# EAGLE design Vending_Machine (EAGLE 9.4.1)
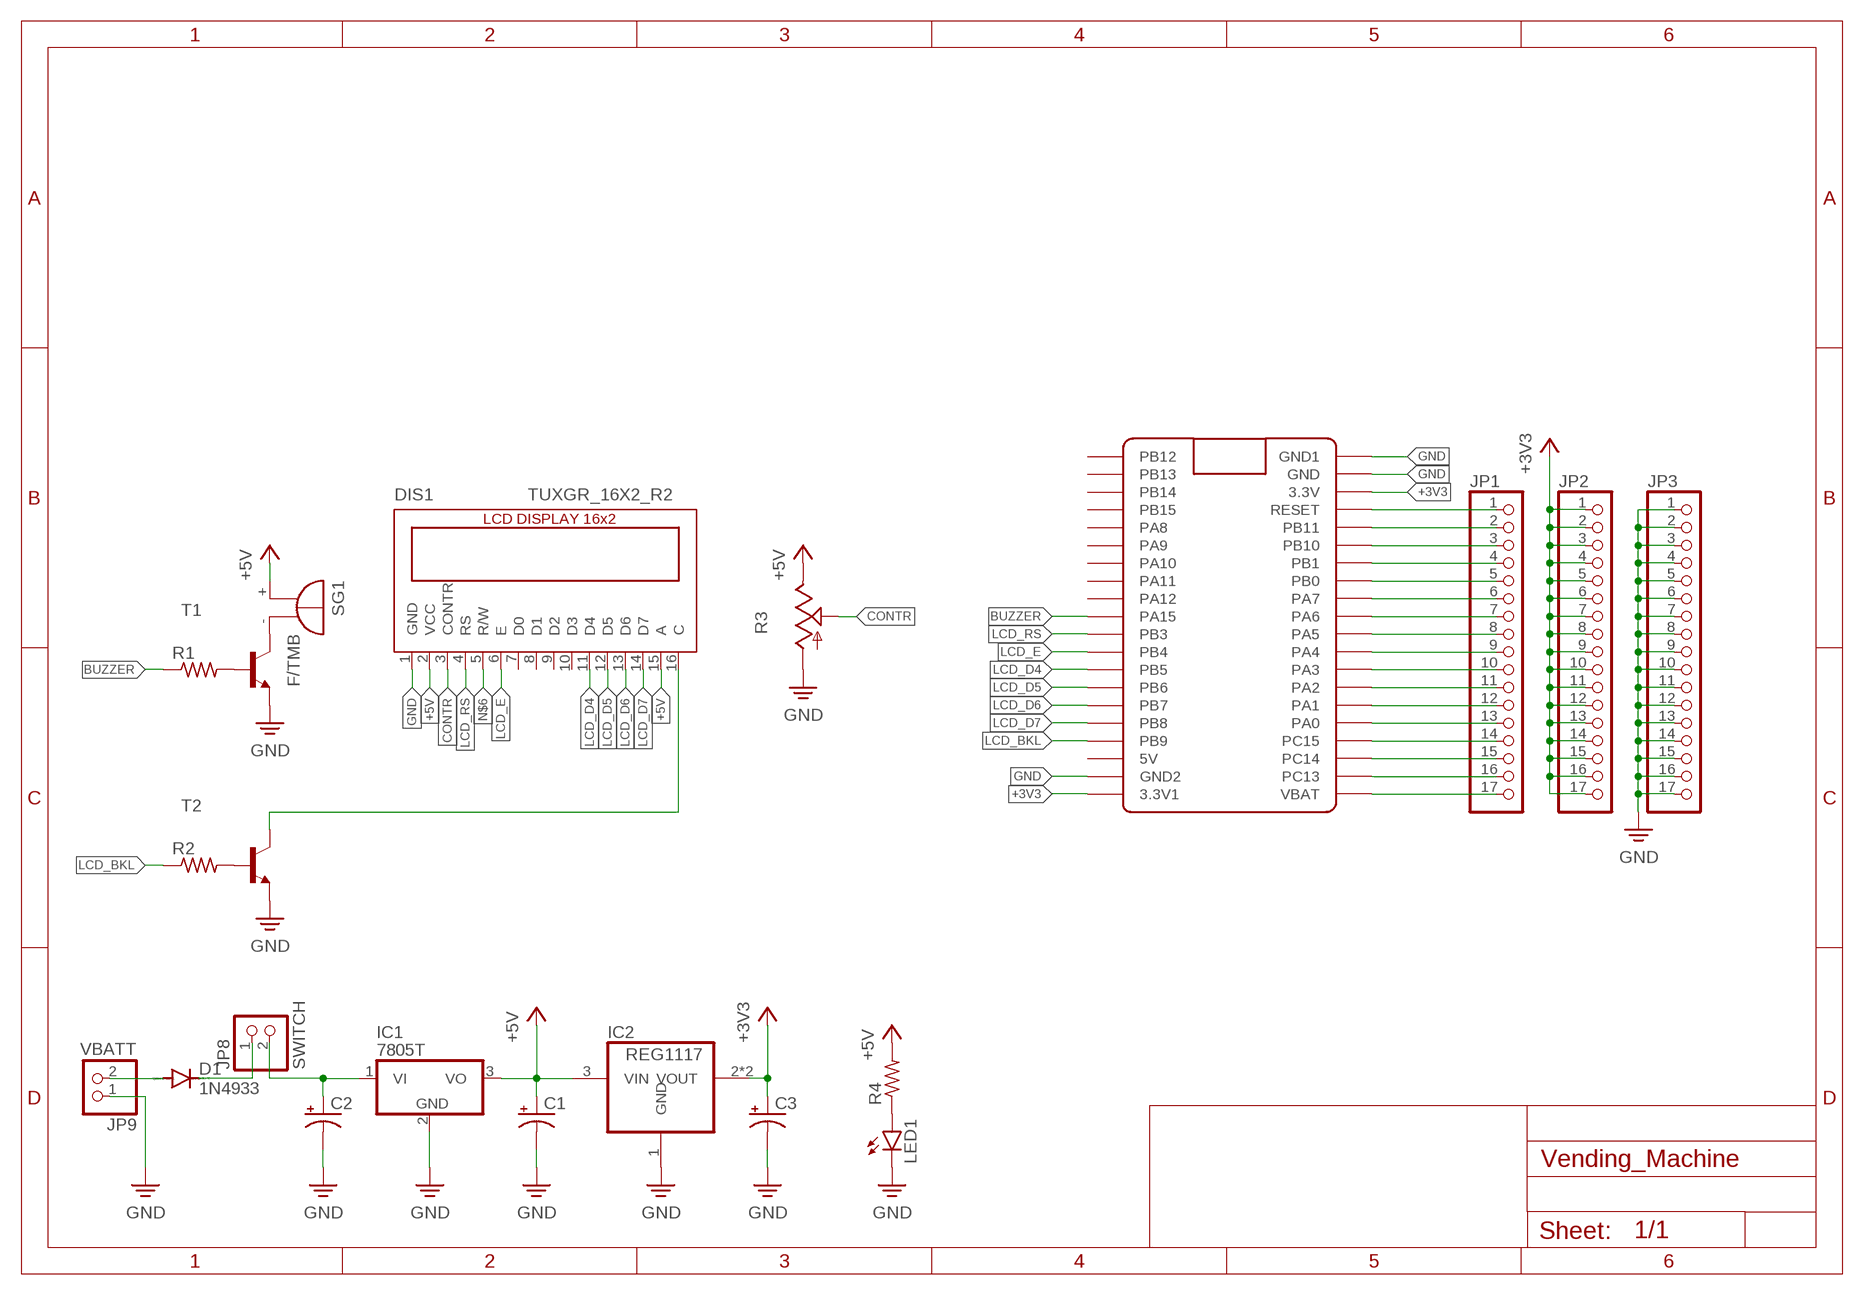
[diagram p0: schematic, sheet 1]

## Parts
C1  CPOL-USE2.5-6  [E2,5-6]
C2  CPOL-USE2.5-6  [E2,5-6]
C3  CPOL-USE2.5-6  [E2,5-6]
D1  1N4933  [DO41-10]
DIS1  TUXGR_16X2_R2  [TUXGR_16X2_R2]
IC1  7805T  [TO220H]
IC2  REG1117  [SOT223]
JP1  PINHD-1X17  [1X17]
JP2  PINHD-1X17  [1X17]
JP3  PINHD-1X17  [1X17]
JP8  SWITCH  PINHD-1X2  [1X02]
JP9  VBATT  PINHD-1X2  [1X02]
LED1  LED3MM  [LED3MM]
R1  R-US_0204/7  [0204/7]
R2  R-US_0204/7  [0204/7]
R3  TRIM_US-CA6V  [CA6V]
R4  R-US_0204/7  [0204/7]
SG1  F/TMB  [F/TMB]
T1  BC167-NPN-TO92-ECB  [TO92-ECB]
T2  BC167-NPN-TO92-ECB  [TO92-ECB]
U$1  BLUE_PILL  [BLUE_PILL]

## Nets
+3V3: C3.+ IC2.2(VOUT) IC2.4(VOUT) JP2.1 JP2.2 JP2.3 JP2.4 JP2.5 JP2.6 JP2.7 JP2.8 JP2.9 JP2.10 JP2.11 JP2.12 JP2.13 JP2.14 JP2.15 JP2.16 JP2.17 U$1.P$20(3.3V1) U$1.P$23(3.3V)
+5V: C1.+ DIS1.2(VCC) DIS1.15(A) IC1.3(VO) IC2.3(VIN) R3.E R4.2 SG1.+
BUZZER: R1.1 U$1.P$10(PA15)
CONTR: DIS1.3(CONTR) R3.S
GND: C1.- C2.- C3.- DIS1.1(GND) IC1.2(GND) IC2.1(GND) JP3.1 JP3.2 JP3.3 JP3.4 JP3.5 JP3.6 JP3.7 JP3.8 JP3.9 JP3.10 JP3.11 JP3.12 JP3.13 JP3.14 JP3.15 JP3.16 JP3.17 JP9.1 LED1.K(C) R3.A T1.E T2.E U$1.P$19(GND2) U$1.P$21(GND1) U$1.P$22(GND)
LCD_BKL: R2.1 U$1.P$17(PB9)
LCD_D4: DIS1.11(D4) U$1.P$13(PB5)
LCD_D5: DIS1.12(D5) U$1.P$14(PB6)
LCD_D6: DIS1.13(D6) U$1.P$15(PB7)
LCD_D7: DIS1.14(D7) U$1.P$16(PB8)
LCD_E: DIS1.6(E) U$1.P$12(PB4)
LCD_RS: DIS1.4(RS) U$1.P$11(PB3)
N$1: SG1.- T1.C
N$2: R1.2 T1.B
N$3: R2.2 T2.B
N$4: JP1.17 U$1.P$40(VBAT)
N$5: C2.+ IC1.1(VI) JP8.2
N$6: DIS1.5(R/W)
N$7: D1.C JP8.1
N$8: D1.A JP9.2
N$9: LED1.A R4.1
N$18: DIS1.16(C) T2.C
PA0: JP1.13 U$1.P$36(PA0)
PA1: JP1.12 U$1.P$35(PA1)
PA2: JP1.11 U$1.P$34(PA2)
PA3: JP1.10 U$1.P$33(PA3)
PA4: JP1.9 U$1.P$32(PA4)
PA5: JP1.8 U$1.P$31(PA5)
PA6: JP1.7 U$1.P$30(PA6)
PB1: JP1.4 U$1.P$27(PB1)
PB10: JP1.3 U$1.P$26(PB10)
PB11: JP1.2 U$1.P$25(PB11)
PB_BATAL: JP1.6 U$1.P$29(PA7)
PB_START: JP1.5 U$1.P$28(PB0)
PC13: JP1.16 U$1.P$39(PC13)
PC14: JP1.15 U$1.P$38(PC14)
PC15: JP1.14 U$1.P$37(PC15)
RESET: JP1.1 U$1.P$24(RESET)
Unconnected: DIS1.7(D0) DIS1.8(D1) DIS1.9(D2) DIS1.10(D3) U$1.P$1(PB12) U$1.P$2(PB13) U$1.P$3(PB14) U$1.P$4(PB15) U$1.P$5(PA8) U$1.P$6(PA9) U$1.P$7(PA10) U$1.P$8(PA11) U$1.P$9(PA12) U$1.P$18(5V)

## Library data of the parts
C1-C3 = rcl:CPOL-US: POLARIZED CAPACITOR, American symbol; SPICEPREFIX: C
D1 = diode:1N4933: DIODE fast recovery rectifier, 1A
DIS1 = display-lcd:TUXGR_16X2_R2: Tuxgraphics LCD display 16x2 characters reflective, without background light Source: tuxgr_12x2_r2.pdf; OC_FARNELL: unknown; OC_NEWARK: unknown
IC1 = linear:78*: Positive VOLTAGE REGULATOR Source: http://cache.national.com/ds/LM/LM78L05.pdf http://www.fairchildsemi.com/ds/LM/LM7805.pdf
IC2 = burr-brown:REG1117: 800mA and 1A Low Dropout (LDO) Positive Regulator 1.8V, 2.5V, 2.85V, 3.3V, 5V, and Adj; MPN: REG1117; OC_FARNELL: 1097566; OC_NEWARK: 14P6981
JP1-JP3 = pinhead:PINHD-1X17: PIN HEADER
JP8 JP9 = pinhead:PINHD-1X2: PIN HEADER
LED1 = led:LED: LED OSRAM: - CHIPLED LG R971, LG N971, LY N971, LG Q971, LY Q971, LO R971, LY R971 LH N974, LH R974 LS Q976, LO Q976, LY Q976 LO Q996 - Hyper CHIPLED LW Q18S LB Q993, LB Q99A, LB R99A - SideLED LS A670, LO A670, LY A670, LG A670, LP A670 LB A673, LV A673, LT A673, LW A673 LH A674 LY A675 LS A676, LA A676, LO A676, LY A676, LW A676 LS A679, LY A679, LG A679 - Hyper Micro SIDELED® LS Y876, LA Y876, LO Y876, LY Y876 LT Y87S - SmartLED LW L88C, LW L88S LB L89C, LB L89S, LG L890 LS L89K, LO L89K, LY L89K LS L896, LA L896, LO L896, LY L896 - TOPLED LS T670, LO T670, LY T670, LG T670, LP T670 LSG T670, LSP T670, LSY T670, LOP T670, LYG T670 LG T671, LOG T671, LSG T671 LB T673, LV T673, LT T673, LW T673 LH T674 LS T676, LA T676, LO T676, LY T676, LB T676, LH T676, LSB T676, LW T676 LB T67C, LV T67C, LT T67C, LS T67K, LO T67K, LY T67K, LW E67C LS E67B, LA E67B, LO E67B, LY E67B, LB E67C, LV E67C, LT E67C LW T67C LS T679, LY T679, LG T679 LS T770, LO T770, LY T770, LG T770, LP T770 LB T773, LV T773, LT T773, LW T773 LH T774 LS E675, LA E675, LY E675, LS T675 LS T776, LA T776, LO T776, LY T776, LB T776 LHGB T686 LT T68C, LB T68C - Hyper Mini TOPLED® LB M676 - Mini TOPLED Santana® LG M470 LS M47K, LO M47K, LY M47K Source: http://www.osram.convergy.de LUXEON: - LUMILED® LXK2-PW12-R00, LXK2-PW12-S00, LXK2-PW14-U00, LXK2-PW14-V00 LXK2-PM12-R00, LXK2-PM12-S00, LXK2-PM14-U00 LXK2-PE12-Q00, LXK2-PE12-R00, LXK2-PE12-S00, LXK2-PE14-T00, LXK2-PE14-U00 LXK2-PB12-K00, LXK2-PB12-L00, LXK2-PB12-M00, LXK2-PB14-N00, LXK2-PB14-P00, LXK2-PB14-Q00 LXK2-PR12-L00, LXK2-PR12-M00, LXK2-PR14-Q00, LXK2-PR14-R00 LXK2-PD12-Q00, LXK2-PD12-R00, LXK2-PD12-S00 LXK2-PH12-R00, LXK2-PH12-S00 LXK2-PL12-P00, LXK2-PL12-Q00, LXK2-PL12-R00 Source: www.luxeon.com KINGBRIGHT: KA-3528ASYC Source: www.kingbright.com
R1 R2 R4 = rcl:R-US_: RESISTOR, American symbol; SPICEPREFIX: R
R3 = pot:TRIM_US-: POTENTIOMETER
SG1 = buzzer:F/TMB: BUZZER Source: Buerklin; OC_FARNELL: unknown; OC_NEWARK: unknown
T1 T2 = transistor:*-NPN-: NPN Transistror BF959 corrected 2008.03.06
U$1 = BluePill:BLUE_PILL

## Board
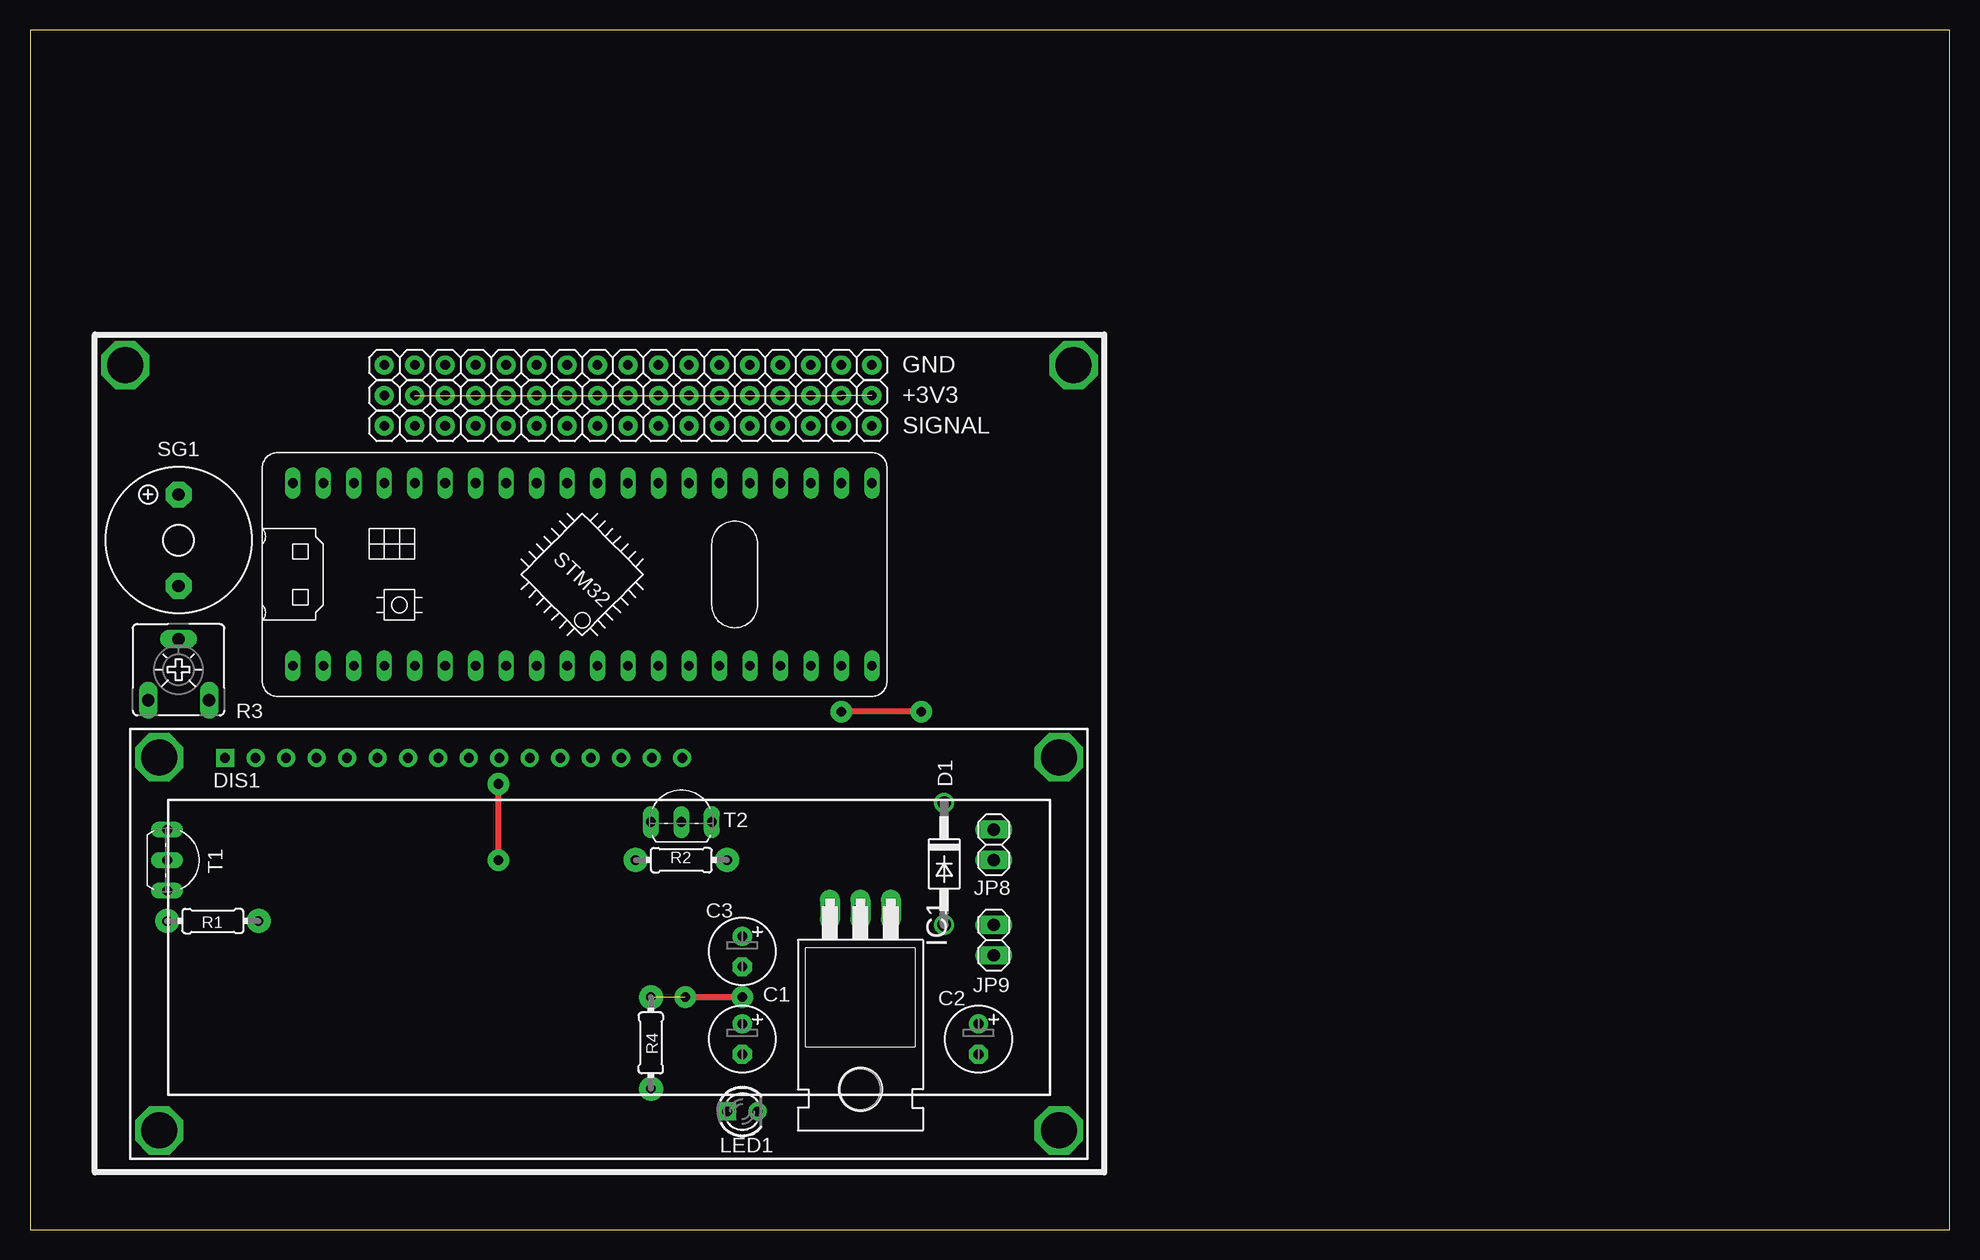
[diagram p1: board, top side]
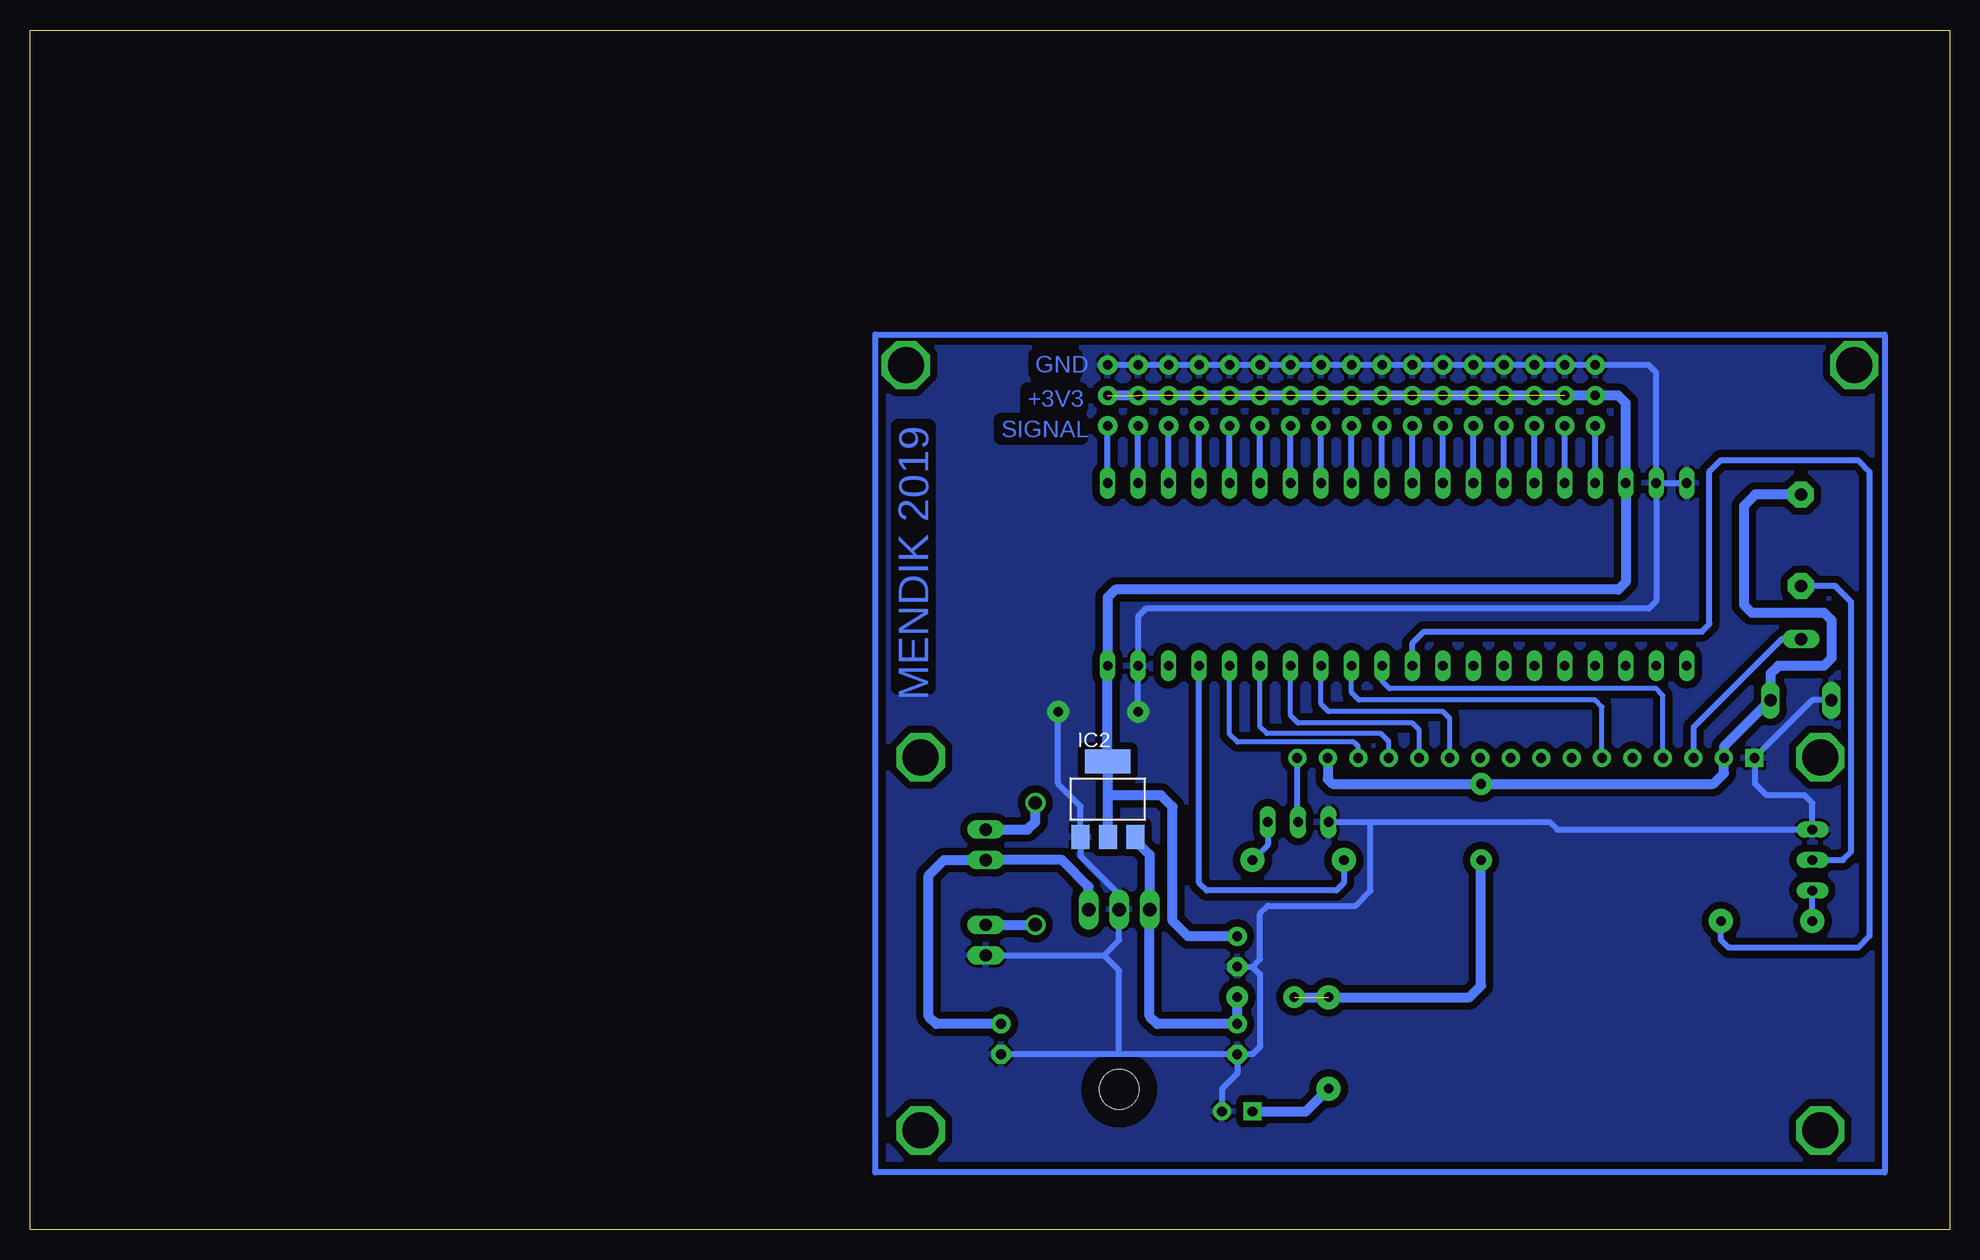
[diagram p2: board, bottom side, seen from below]

Size 160 x 100 mm. Coordinates in mm from the lower left corner, seen from the top.
Outline: 0,0 160,0 160,100 0,100 0,0
Copper layers (1*16): Top 0.035mm / dielectric 1.5mm / Bottom 0.035mm
Design rules "default *": minimum track width 6mil, minimum drill 0.35mm, track to track 12mil, track to pad 12mil, pad to pad 12mil, via to via 12mil, smd to smd 12mil, copper to edge 40mil, drill to drill 6mil, minimum pad ring 10mil, minimum via ring 8mil, stop-mask expansion 4mil, vias tented up to drill 0mil, thermal gap 10mil

### Footprints (pad centres in the part's own frame; a part is rotated, then mirrored left to right if it is on the bottom)
E2,5-6 = drill 0.813 pad 1.6: + -1.27,0 | drill 0.813 pad 1.6 octagon: - 1.27,0
DO41-10 = drill 1.118: A 5.08,0; C -5.08,0
TUXGR_16X2_R2 = drill 0.8 pad 1.5 square: 1 -32,15.5 | drill 0.8 pad 1.5: 2 -29.46,15.5; 3 -26.92,15.5; 4 -24.38,15.5; 5 -21.84,15.5; 6 -19.3,15.5; 7 -16.76,15.5; 8 -14.22,15.5; 9 -11.68,15.5; 10 -9.14,15.5; 11 -6.6,15.5; 12 -4.06,15.5; 13 -1.52,15.5; 14 1.02,15.5; 15 3.56,15.5; 16 6.1,15.5 | drill 3 pad 4 octagon: P$1 -37.494,15.557; P$2 37.494,15.557; P$3 -37.494,-15.557; P$4 37.494,-15.557
TO220H = drill 1.118 long: 1 -2.54,-10.16; 2 0,-10.16; 3 2.54,-10.16 | hole 3.302: 0,4.826
SOT223 = smd 1.499 x 2.007: 1 -2.261,-3.15; 2 0.025,-3.15; 3 2.311,-3.15 | smd 3.81 x 2.007: 4 0,3.15
1X17 = drill 0.8 pad 1.6: 1 -20.32,0; 2 -17.78,0; 3 -15.24,0; 4 -12.7,0; 5 -10.16,0; 6 -7.62,0; 7 -5.08,0; 8 -2.54,0; 9 0,0; 10 2.54,0; 11 5.08,0; 12 7.62,0; 13 10.16,0; 14 12.7,0; 15 15.24,0; 16 17.78,0; 17 20.32,0
1X02 = drill 1.016 long: 1 -1.27,0; 2 1.27,0
LED3MM = drill 0.813 pad 1.5 square: A -1.27,0 | drill 0.813 pad 1.5: K 1.27,0
0204/7 = drill 0.813 pad 2: 1 -3.81,0; 2 3.81,0
CA6V = drill 1.016 long: A -2.54,-2.54; E 2.54,-2.54; S 0,2.54
F/TMB = drill 1.016 pad 2.159 octagon: + 3.81,0; - -3.81,0
TO92-ECB = drill 0.813 long: B 2.54,0; C 0,0; E -2.54,0
BLUE_PILL = drill 0.8 long: P$1 -7.62,15.24; P$2 -7.62,12.7; P$3 -7.62,10.16; P$4 -7.62,7.62; P$5 -7.62,5.08; P$6 -7.62,2.54; P$7 -7.62,0; P$8 -7.62,-2.54; P$9 -7.62,-5.08; P$10 -7.62,-7.62; P$11 -7.62,-10.16; P$12 -7.62,-12.7; P$13 -7.62,-15.24; P$14 -7.62,-17.78; P$15 -7.62,-20.32; P$16 -7.62,-22.86; P$17 -7.62,-25.4; P$18 -7.62,-27.94; P$19 -7.62,-30.48; P$20 -7.62,-33.02; P$21 7.62,15.24; P$22 7.62,12.7; P$23 7.62,10.16; P$24 7.62,7.62; P$25 7.62,5.08; P$26 7.62,2.54; P$27 7.62,0; P$28 7.62,-2.54; P$29 7.62,-5.08; P$30 7.62,-7.62; P$31 7.62,-10.16; P$32 7.62,-12.7; P$33 7.62,-15.24; P$34 7.62,-17.78; P$35 7.62,-20.32; P$36 7.62,-22.86; P$37 7.62,-25.4; P$38 7.62,-27.94; P$39 7.62,-30.48; P$40 7.62,-33.02

### Placement (x,y rotation side)
C1  59.37,15.88 270 top
C2  79.06,15.88 270 top
C3  59.37,23.18 270 top
D1  76.2,30.48 270 top
DIS1  48.26,23.81 0 top
IC1  69.22,16.51 180 top
IC2  70.17,35.88 0 bottom
JP1  49.85,66.99 0 top
JP2  49.85,69.53 0 top
JP3  49.85,72.07 0 top
JP8  80.33,32.07 270 top
JP9  80.33,24.13 90 top
LED1  59.37,9.84 0 top
R1  15.24,25.72 180 top
R2  54.29,30.8 0 top
R3  12.38,46.67 0 top
R4  51.75,15.56 90 top
SG1  12.38,57.47 90 top
T1  11.43,30.8 270 top
T2  54.29,33.97 0 top
U$1  37.15,54.61 90 top

### Tracks (layer width: path | path; a pad name or v marks a point on that pad's centre or on a via)
+3V3  (15 unrouted)
  Bottom 0.508: IC2.4 70.17,39.69 70.14,39.66
  Bottom 0.813: 70.17,39.69 U$1.P$20 70.17,52.7 69.53,53.34 27.62,53.34 26.99,53.98 U$1.P$23 26.99,68.9 27.62,69.53 JP2.1 JP2.17 | IC2.2 70.14,36.2 | 70.14,36.2 70.14,39.66 | C3.+ 63.5,24.45 64.77,25.72 64.77,35.24 65.72,36.2 70.14,36.2
+5V  (via drill 0.8 pad 1.8)  (1 unrouted)
  Top 0.508: v59.37,19.37 v54.61,19.37 | v39.05,30.8 v39.05,37.15
  Bottom 0.508: 67.86,32.41 IC2.3
  Bottom 0.813: SG1.+ 16.19,61.28 17.14,60.33 17.14,52.07 16.51,51.44 10.48,51.44 9.84,50.8 9.84,47.62 10.48,46.99 14.29,46.99 14.92,46.35 R3.E 18.8,40.26 DIS1.2 18.8,38.03 19.68,37.15 v39.05,37.15 51.44,37.15 51.82,37.53 DIS1.15 | 67.86,32.41 66.67,31.23 IC1.3 66.67,17.78 66.04,17.14 C1.+ v59.37,19.37 | v54.61,19.37 40.01,19.37 39.05,20.32 v39.05,30.8
BUZZER
  Bottom 0.508: U$1.P$10 44.77,48.9 43.81,49.85 20.64,49.85 20,50.48 20,63.18 19.05,64.14 7.62,64.14 6.67,63.18 6.67,24.45 7.62,23.5 18.41,23.5 19.05,24.13 R1.1
CONTR
  Bottom 0.508: R3.S 13.98,49.21 21.34,41.85 DIS1.3
GND  (via drill 0.8 pad 1.8)
  Top 0.508: v74.3,43.18 v67.63,43.18
  Bottom 0.508: R3.A 11.44,44.13 DIS1.1 16.19,39.24 16.19,37.15 15.24,36.2 12.06,36.2 11.43,35.56 T1.E | 80.01,22.54 JP9.1 70.48,22.86 | 70.48,22.86 69.22,24.13 IC1.2 69.22,27.94 72.43,31.15 IC2.1 72.43,35.28 74.3,37.15 v74.3,43.18 | C1.- 69.22,14.61 | 69.22,14.61 C2.- | C3.- 58.1,21.91 | 58.1,21.91 57.47,21.27 57.47,15.24 58.1,14.61 C1.- | 69.22,14.61 69.22,21.59 70.48,22.86 | T2.E 48.26,33.97 | 48.26,33.97 33.34,33.97 32.7,33.34 10.79,33.34 | 58.1,21.91 57.47,22.54 57.47,26.35 56.83,26.99 49.53,26.99 48.26,28.26 48.26,33.97 | U$1.P$22 U$1.P$21 | U$1.P$22 24.45,52.39 25.08,51.75 66.99,51.75 67.63,51.12 U$1.P$19 v67.63,43.18 | JP3.17 JP3.1 25.08,72.07 24.45,71.44 U$1.P$22 | LED1.K 60.64,11.75 59.37,13.02 C1.-
  pour Bottom (isolate 0.61): 5.4,74.61 89.53,74.61 89.53,4.76 5.4,4.76
LCD_BKL
  Bottom 0.508: R2.1 50.48,28.89 51.12,28.26 61.91,28.26 62.55,28.89 U$1.P$17
LCD_D4
  Bottom 0.406: DIS1.11 41.66,42.61 42.23,43.18 51.75,43.18 52.39,43.81 U$1.P$13
LCD_D5
  Bottom 0.406: DIS1.12 44.2,41.66 44.77,42.23 54.29,42.23 54.93,42.86 U$1.P$14
LCD_D6
  Bottom 0.406: DIS1.13 46.74,40.71 47.38,41.35 56.91,41.35 57.47,41.91 U$1.P$15
LCD_D7
  Bottom 0.406: DIS1.14 49.28,40.27 49.66,40.64 59.37,40.64 60.01,41.27 U$1.P$16
LCD_E
  Bottom 0.406: DIS1.6 28.96,43.56 29.53,44.13 49.21,44.13 49.85,44.77 U$1.P$12
LCD_RS
  Bottom 0.406: DIS1.4 23.88,44.52 24.45,45.09 46.67,45.09 47.31,45.72 U$1.P$11
N$1
  Bottom 0.508: T1.C 8.89,30.8 8.2,31.49 8.2,52.33 9.53,53.66 SG1.-
N$2
  Bottom 0.508: R1.2 T1.B
N$3
  Bottom 0.508: T2.B 56.83,32.07 R2.2
N$4
  Bottom 0.508: U$1.P$40 JP1.17
N$5
  Bottom 0.813: C2.+ 84.45,17.14 85.09,17.78 85.09,29.53 83.82,30.8 JP8.2 73.98,30.8 71.75,28.57 IC1.1
N$7
  Bottom 0.813: JP8.1 76.83,33.34 76.2,33.97 D1.C
N$8
  Bottom 0.813: JP9.2 D1.A
N$9
  Bottom 0.813: LED1.A 53.66,9.84 R4.1
N$10
  Bottom 0.508: 5.4,4.76 89.53,4.76 89.53,74.61 5.4,74.61 5.4,4.76
N$11  (via drill 3 pad 3)
  other vias: 7.94,72.07
N$12  (via drill 3 pad 3)
  other vias: 87,72.07
N$18
  Bottom 0.508: T2.C 54.36,34.04 DIS1.16
PA0
  Bottom 0.508: U$1.P$36 JP1.13
PA1
  Bottom 0.508: U$1.P$35 JP1.12
PA2
  Bottom 0.508: U$1.P$34 JP1.11
PA3
  Bottom 0.508: U$1.P$33 JP1.10
PA4
  Bottom 0.508: U$1.P$32 JP1.9
PA5
  Bottom 0.508: U$1.P$31 JP1.8
PA6
  Bottom 0.508: U$1.P$30 JP1.7
PB1
  Bottom 0.508: U$1.P$27 JP1.4
PB10
  Bottom 0.508: U$1.P$26 JP1.3
PB11
  Bottom 0.508: U$1.P$25 JP1.2
PB_BATAL
  Bottom 0.508: U$1.P$29 JP1.6
PB_START
  Bottom 0.508: U$1.P$28 JP1.5
PC13
  Bottom 0.508: U$1.P$39 JP1.16
PC14
  Bottom 0.508: U$1.P$38 JP1.15
PC15
  Bottom 0.508: U$1.P$37 JP1.14
RESET
  Bottom 0.508: U$1.P$24 JP1.1

### Text on the board
Bottom: GND | +3V3 | MENDIK 2019 | SIGNAL
tPlace: GND | +3V3 | SIGNAL